# Altium project KB PoC.PrjPCB
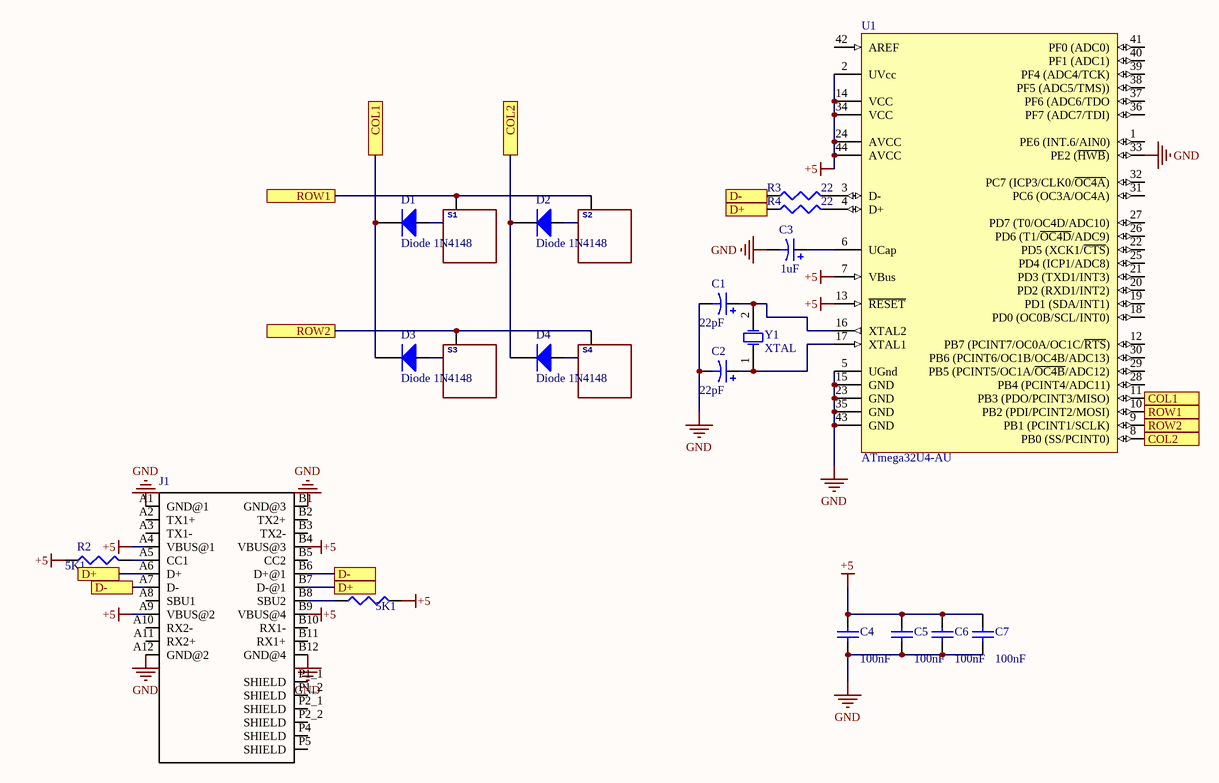
[diagram p0: KB PoC.SchDoc]
1 sheet, 22 parts. Net scope: flat (ports and power ports of the same name join across sheets).
Board file: KB PoC.PcbDoc

## Sheet KB PoC.SchDoc
size A4

### Parts
C1  value 22pF  [C0805]  (hidden comment: Cap Pol3)
C2  value 22pF  [C0805]  (hidden comment: Cap Pol3)
C3  value 1uF  [C0805]  (hidden comment: Cap Pol3)
C4  value 100nF  [6-0805_N]  (hidden comment: Cap)
C5  value 100nF  [6-0805_N]  (hidden comment: Cap)
C6  value 100nF  [6-0805_N]  (hidden comment: Cap)
C7  value 100nF  [6-0805_N]  (hidden comment: Cap)
D1  Diode 1N4148  [DO-35]
D2  Diode 1N4148  [DO-35]
D3  Diode 1N4148  [DO-35]
D4  Diode 1N4148  [DO-35]
J1  1-2295018-2  [TE_1-2295018-2_1-2295018-2(Primary)]  (value not drawn)
R1  value 5K1  [J1-0603]  (hidden comment: Res3)
R2  value 5K1  [J1-0603]  (hidden comment: Res3)
R3  value 22  [J1-0603]  (hidden comment: Res3)
R4  value 22  [J1-0603]  (hidden comment: Res3)
S1  KEYSWITCH-PLAIN-MX-1U  [MX-1U-RGB]  (value not drawn)
S2  KEYSWITCH-PLAIN-MX-1U  [MX-1U-RGB]  (value not drawn)
S3  KEYSWITCH-PLAIN-MX-1U  [MX-1U-RGB]  (value not drawn)
S4  KEYSWITCH-PLAIN-MX-1U  [MX-1U-RGB]  (value not drawn)
U1  ATmega32U4-AU  [44ML_N]
Y1  XTAL  [R38]

### Ports
COL1, COL2, D+, D-, ROW1, ROW2

### Nets
+5: C4.2 C5.2 C6.2 C7.2 J1.A4(VBUS@1) J1.A9(VBUS@2) J1.B4(VBUS@3) J1.B9(VBUS@4) R1.2 R2.1 U1.2(UVcc) U1.7(VBus) U1.13(~{RESET}) U1.14(VCC) U1.24(AVCC) U1.34(VCC) U1.44(AVCC)
GND: C1.2 C2.2 C3.2 C4.1 C5.1 C6.1 C7.1 J1.A1(GND@1) J1.A12(GND@2) J1.B1(GND@3) J1.B12(GND@4) U1.5(UGnd) U1.15(GND) U1.23(GND) U1.33(PE2_(~{HWB})) U1.35(GND) U1.43(GND)
NetC1_1: C1.1 U1.16(XTAL2) Y1.2(OSC2)
NetC2_1: C2.1 U1.17(XTAL1) Y1.1(OSC1)
NetC3_1: C3.1 U1.6(UCap)
NetD1_1: D1.1(A) S1.MX1(P0)
NetD1_2: D1.2(K) D3.2(K) U1.11(PB3_(PDO/PCINT3/MISO)) ; port COL1
NetD2_1: D2.1(A) S2.MX1(P0)
NetD2_2: D2.2(K) D4.2(K) U1.8(PB0_(SS/PCINT0)) ; port COL2
NetD3_1: D3.1(A) S3.MX1(P0)
NetD4_1: D4.1(A) S4.MX1(P0)
NetJ1_A5: J1.A5(CC1) R2.2
NetJ1_A6: J1.A6(D+) J1.B7(D-@1) R4.1 ; port D+
NetJ1_A7: J1.A7(D-) J1.B6(D+@1) R3.1 ; port D-
NetJ1_B8: J1.B8(SBU2) R1.1
NetR3_2: R3.2 U1.3(D-)
NetR4_2: R4.2 U1.4(D+)
NetS1_MX2: S1.MX2(P1) S2.MX2(P1) U1.10(PB2_(PDI/PCINT2/MOSI)) ; port ROW1
NetS3_MX2: S3.MX2(P1) S4.MX2(P1) U1.9(PB1_(PCINT1/SCLK)) ; port ROW2

Not connected (* = marked no-connect by the designer): J1 A2(TX1+) A3(TX1-) A8(SBU1) A10(RX2-) A11(RX2+) B2(TX2+) B3(TX2-) B5(CC2) B10(RX1-) B11(RX1+) P1_1(SHIELD) P1_2(SHIELD) P2_1(SHIELD) P2_2(SHIELD) P4(SHIELD) P5(SHIELD); U1 1(PE6_(INT.6/AIN0)) 12(PB7_(PCINT7/OC0A/OC1C/~{RTS})) 18(PD0_(OC0B/SCL/INT0)) 19(PD1_(SDA/INT1)) 20(PD2_(RXD1/INT2)) 21(PD3_(TXD1/INT3)) 22(PD5_(XCK1/~{CTS})) 25(PD4_(ICP1/ADC8)) 26(PD6_(T1/~{OC4D}/ADC9)) 27(PD7_(T0/OC4D/ADC10)) 28(PB4_(PCINT4/ADC11)) 29(PB5_(PCINT5/OC1A/~{OC4B}/ADC12)) 30(PB6_(PCINT6/OC1B/OC4B/ADC13)) 31(PC6_(OC3A/OC4A)) 32(PC7_(ICP3/CLK0/~{OC4A})) 36(PF7_(ADC7/TDI)) 37(PF6_(ADC6/TDO) 38(PF5_(ADC5/TMS))) 39(PF4_(ADC4/TCK)) 40(PF1_(ADC1)) 41(PF0_(ADC0)) 42(AREF)

### Library data of the parts
C1-C3 = Cap Pol3: Polarized Capacitor (Surface Mount); Published: 8-Jun-2000; LatestRevisionDate: 29-May-2009; LatestRevisionNote: IPC-7351 Footprint Added.; PackageReference: C0805; Publisher: Altium Limited; PackageDescription: Chip Capacitor
C4-C7 = Cap: Capacitor; Published: 8-Jun-2000; LatestRevisionDate: 17-Jul-2002; LatestRevisionNote: Re-released for DXP Platform.; PackageReference: RAD-0.3; Publisher: Altium Limited; PackageDescription: Radial Cap, Thru-Hole; 2 Leads; 0.3 in Pin Spacing
D1-D4 = Diode 1N4148: High Conductance Fast Diode; Published: 8-Jun-2000; LatestRevisionDate: 17-Jul-2002; LatestRevisionNote: Re-released for DXP Platform.; DatasheetVersion: 1997; PackageReference: DO-35; Publisher: Altium Limited; PackageDescription: Diode, Axial; Body 3.8 x 1.9 mm (LxDia. max), Lead Dia. 0.53 mm (max); Code_JEDEC: DO-204-AH; ComponentLink1Description: Manufacturer Link; ComponentLink1URL: http://www.fairchildsemi.com/; ComponentLink2Description: Datasheet; ComponentLink2URL: http://www.fairchildsemi.com/ds/1N%2F1N4148.pdf
J1 = 1-2295018-2: USB TYPE C, REC OFFSET 0.65MM DUAL SMT; Centerline_Pitch: .5 mm[.019 in]; MF: TE Connectivity; Number_of_Positions: 24; Product_Type: Connector; Package: None; Price: 1.78 USD; MP: 1-2295018-2; Availability: Good; SnapEDA_Link: https://www.snapeda.com/parts/1-2295018-2/TE%20Connectivity%20AMP%20Connectors/view-part/?ref=snap; Value: *
R1-R4 = Res3: Resistor; Published: 8-Jun-2000; LatestRevisionDate: 29-May-2009; LatestRevisionNote: IPC-7351 Footprint Added.; PackageReference: J1-0603; Publisher: Altium Limited; PackageDescription: Chip Resistor
S1-S4 = KEYSWITCH-PLAIN-MX-1U: GateName_1: G$1; DeviceName: -MX-1U; SymbolName_1: KEYSWITCH-PLAIN; LibraryName: Keyboard; DeviceSetName: KEYSWITCH-PLAIN; Package: MX-1U
U1 = ATmega32U4-AU: 8-bit AVR Microcontroller, 2.7-5.5V, 16MHz, 32KB Flash, 1KB EEPROM, 2.5KB SRAM, USB Controller, 44-pin TQFP, Industrial Grade (-40°C to 85°C), Ext Osc; DatasheetVersion: revF, Nov-2010; PackageVersion: rev.G, Jul-2007; PackageReference: 44ML; PackageDescription: 44-Pin Plastic Thin Quad Flat Pack, 10 x 10 x 1.0 mm Body, 0.8 mm Pitch (TQFP); ComponentLink1Description: Manufacturer URL; ComponentLink1URL: http://www.atmel.com/; ComponentLink2Description: ATmega16U4/32U4 Datasheet; ComponentLink2URL: http://www.atmel.com/dyn/resources/prod_documents/doc7766.pdf; ComponentLink3Description: ATmega16U4 ATmega32U4 Summary; ComponentLink3URL: http://www.atmel.com/dyn/resources/prod_documents/7766S.pdf
Y1 = XTAL: Crystal Oscillator; Published: 8-Jun-2000; LatestRevisionDate: 17-Jul-2002; LatestRevisionNote: Re-released for DXP Platform.; PackageReference: R38; Publisher: Altium Limited; PackageDescription: Crystal, Thru-Hole; 2 Leads; Body 3.1 x 8.2 mm (Dia.xH)